# EAGLE design ESP12E_DHT22_NO_RF_NEW_v1 (EAGLE 7.4.0)
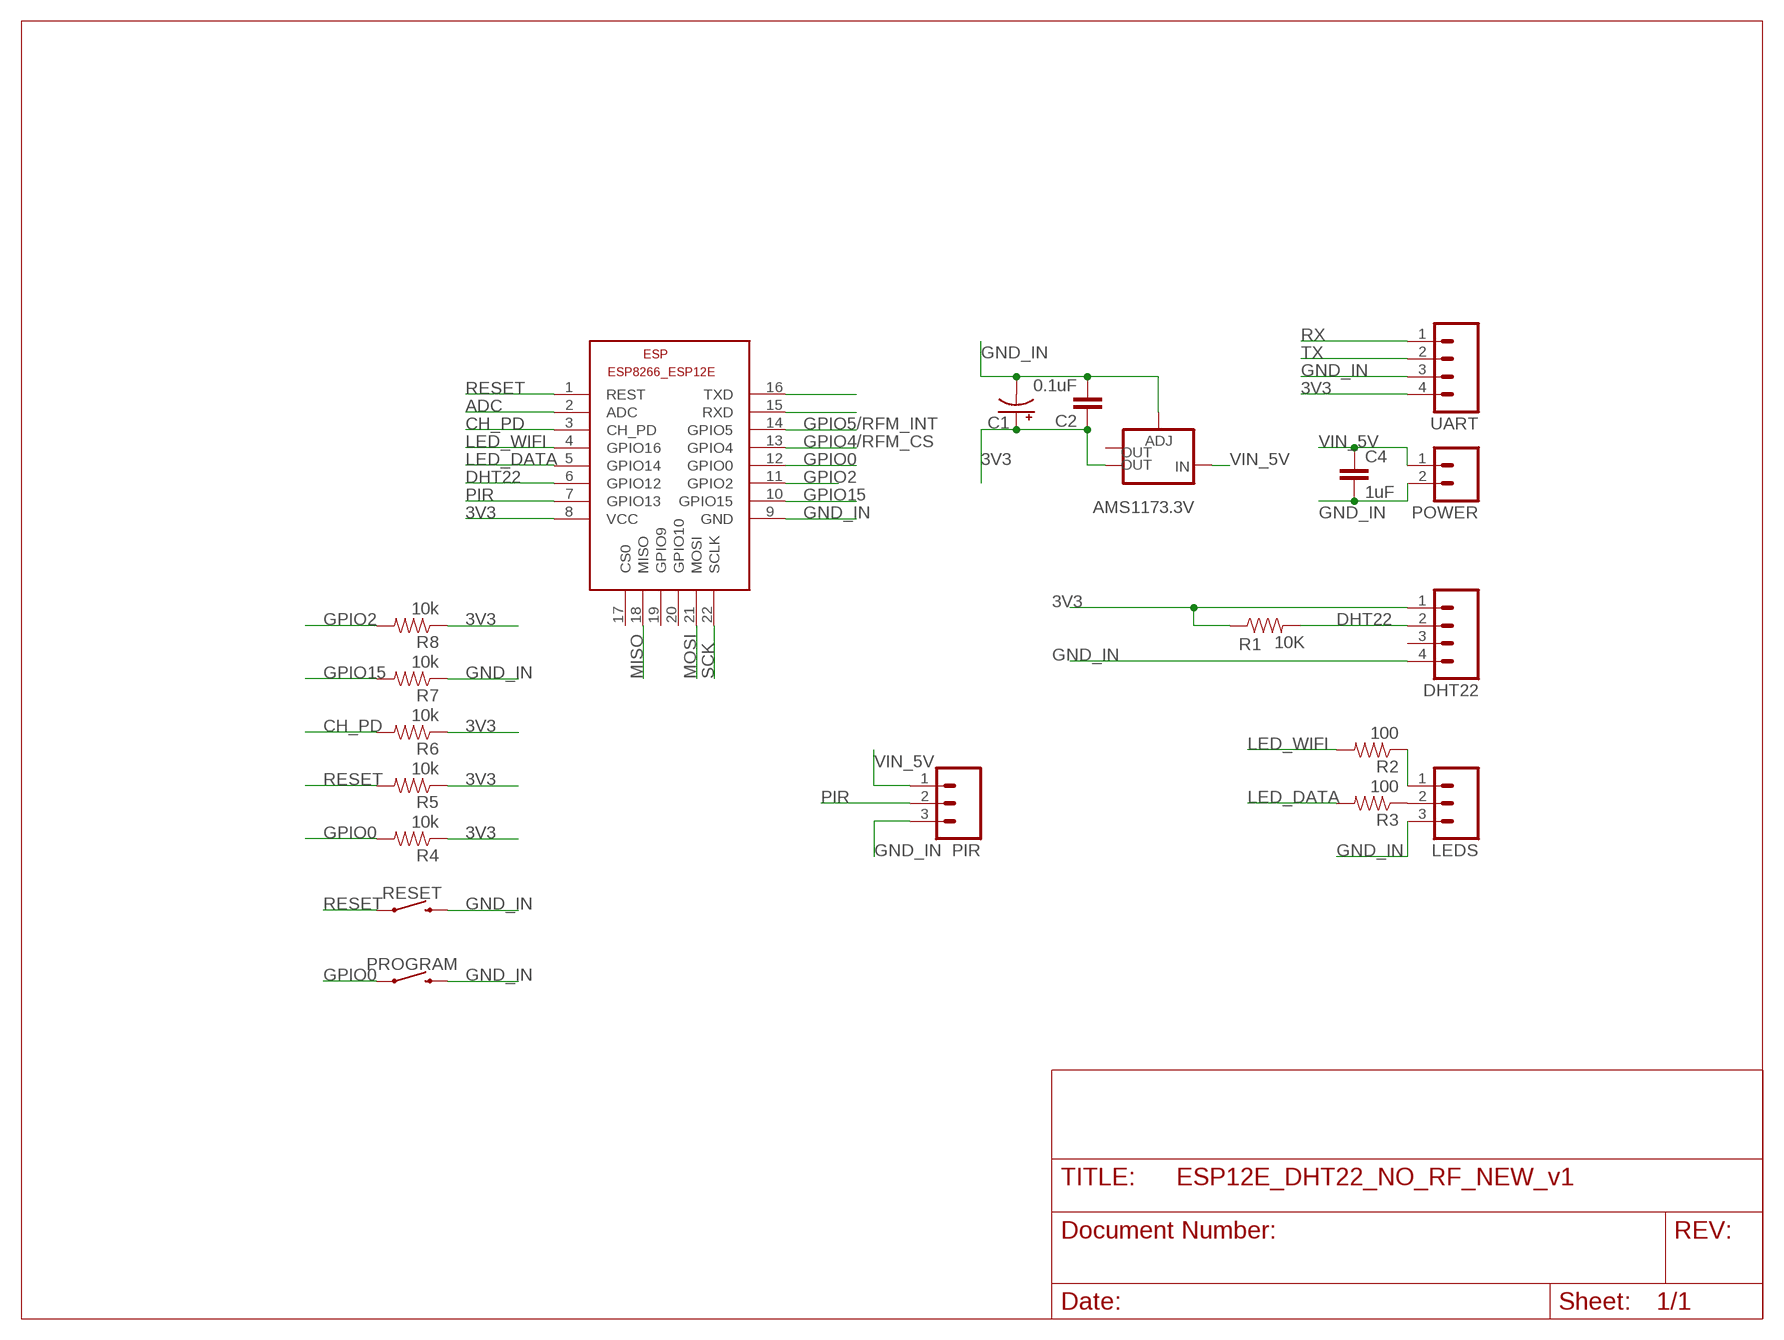
[diagram p0: schematic, sheet 1]

## Parts
AMS1173.3V  V_REG_LM1117SOT223  [SOT223]
C1  CAP_POLC  [PANASONIC_C]
C2  0.1uF  CAP0603-CAP  [0603-CAP]
C4  1uF  CAP0603-CAP  [0603-CAP]
DHT22  M04LONGPADS  [1X04_LONGPADS]
ESP  ESP8266-12EESP8266-ESP12E  [ESP8266-ESP12E]
LEDS  M03PTH  [1X03]
PIR  M03PTH  [1X03]
POWER  M02PTH  [1X02]
PROGRAM  MOMENTARY-SWITCH-SPST-PTH-6.0MM-KIT  [TACTILE_SWITCH_PTH_6.0MM_KIT]
R1  10K  10KOHM-1/10W-1%(0603)0603  [0603-RES]
R2  100  RESISTOR0603  [0603-RES]
R3  100  RESISTOR0603  [0603-RES]
R4  10k  RESISTOR0603  [0603-RES]
R5  10k  RESISTOR0603  [0603-RES]
R6  10k  RESISTOR0603  [0603-RES]
R7  10k  RESISTOR0603  [0603-RES]
R8  10k  RESISTOR0603  [0603-RES]
RESET  MOMENTARY-SWITCH-SPST-PTH-6.0MM-KIT  [TACTILE_SWITCH_PTH_6.0MM_KIT]
UART  M04LONGPADS  [1X04_LONGPADS]

## Nets
3V3: AMS1173.3V.2(OUT) C1.+ C2.1 DHT22.1 ESP.8(VCC) R1.1 R4.1 R5.1 R6.1 R8.1 UART.4
ADC: ESP.2(ADC)
CH_PD: ESP.3(CH_PD) R6.2
DHT22: DHT22.2 ESP.6(GPIO12) R1.2
GND_IN: AMS1173.3V.1(ADJ) C1.- C2.2 C4.2 DHT22.4 ESP.9(GND) LEDS.3 PIR.3 POWER.2 PROGRAM.3 R7.1 RESET.3 UART.3
GPIO0: ESP.12(GPIO0) PROGRAM.1 R4.2
GPIO2: ESP.11(GPIO2) R8.2
GPIO4/RFM_CS: ESP.13(GPIO4)
GPIO5/RFM_INT: ESP.14(GPIO5)
GPIO15: ESP.10(GPIO15) R7.2
LED_DATA: ESP.5(GPIO14) R3.2
LED_WIFI: ESP.4(GPIO16) R2.2
MISO: ESP.18(MISO)
MOSI: ESP.21(MOSI)
N$1: LEDS.2 R3.1
N$2: LEDS.1 R2.1
PIR: ESP.7(GPIO13) PIR.2
RESET: ESP.1(REST) R5.2 RESET.1
RX: ESP.16(TXD) UART.1
SCK: ESP.22(SCLK)
TX: ESP.15(RXD) UART.2
VIN_5V: AMS1173.3V.3(IN) C4.1 PIR.1 POWER.1
Unconnected: AMS1173.3V.4(OUT) DHT22.3 ESP.17(CS0) ESP.19(GPIO9) ESP.20(GPIO10)

## Library data of the parts
AMS1173.3V = SparkFun-PowerIC:V_REG_LM1117: Voltage Regulator LM1117 Standard adjustable voltage regulator but in SMD form. Spark Fun Electronics SKU : COM-00595; PROD_ID: VREG-08170
C1 = SparkFun-Capacitors:CAP_POL: Capacitor Polarized These are standard SMD and PTH capacitors. Normally 10uF, 47uF, and 100uF in electrolytic and tantalum varieties. Always verify the external diameter of the through hole cap, it varies with capacity, voltage, and manufacturer. The EIA devices should be standard.
C2 C4 = SparkFun-Capacitors:CAP: Capacitor Standard 0603 ceramic capacitor, and 0.1" leaded capacitor.
DHT22 UART = SparkFun-Connectors:M04: Header 4 Standard 4-pin 0.1" header. Use with straight break away headers (SKU : PRT-00116), right angle break away headers (PRT-00553), swiss pins (PRT-00743), machine pins (PRT-00117), and female headers (PRT-00115). Molex polarized connector foot print use with SKU : PRT-08231 with associated crimp pins and housings. 1MM SMD Version SKU: PRT-10208; PROD_ID: CONN-09696
ESP = ESP8266-ESP12E:ESP8266-12E: ESP8266-12E with additional I/O and GPIO04/05 corrected The author cannot warrant that this library is free from error or will meet your specific requirements. Created by PuceBaboon.com. Komagane, Nagano, JAPAN
LEDS PIR = SparkFun-Connectors:M03: Header 3 Standard 3-pin 0.1" header. Use with straight break away headers (SKU : PRT-00116), right angle break away headers (PRT-00553), swiss pins (PRT-00743), machine pins (PRT-00117), and female headers (PRT-00115). Molex polarized connector foot print use with SKU : PRT-08232 with associated crimp pins and housings.
POWER = SparkFun-Connectors:M02: Standard 2-pin 0.1" header. Use with - straight break away headers ( PRT-00116) - right angle break away headers (PRT-00553) - swiss pins (PRT-00743) - machine pins (PRT-00117) - female headers (PRT-00115) Molex polarized connector foot print use with: PRT-08233 with associated crimp pins and housings. 2.54_SCREWTERM for use with PRT-10571. 3.5mm Screw Terminal footprints for PRT-08084 5mm Screw Terminal footprints for use with PRT-08432
PROGRAM RESET = SparkFun-Switches:MOMENTARY-SWITCH-SPST: Momentary Switch (Pushbutton) - SPST Normally-open (NO) SPST momentary switches (buttons, pushbuttons). Variants PTH-12MM - 12mm square, through-hole Momentary Pushbutton Switch - 12mm Square <https://www.sparkfun.com/products/9190> (COM-09190) PTH-6.0MM, PTH-6.0MM-KIT - 6.0mm square, through-hole Mini Pushbutton Switch <https://www.sparkfun.com/products/97> (COM-00097) KIT package intended for soldering kit's - only one side of pads' copper is exposed. PTH-RIGHT-ANGLE-KIT - Right-angle, through-hole Right Angle Tactile Button <https://www.sparkfun.com/products/10791> - Used on SparkFun BigTime Watch Kit <https://www.sparkfun.com/products/11734> SMD-12MM - 12mm square, surface-mount Tactile Button - SMD (12mm) <https://www.sparkfun.com/products/12993> (COM-12993) Used on SparkFun PicoBoard <https://www.sparkfun.com/products/11888> SMD-4.5MM - 4.5mm Square Trackball Switch Used on SparkFun Blackberry Trackballer Breakout <https://www.sparkfun.com/products/13169> SMD-4.6MMX2.8MM - 4.60mm x 2.80mm, surface mount Used on SparkFun SAMD21 Mini Breakout <https://www.sparkfun.com/products/13664> SMD-5.2MM, SMD-5.2-REDUNDANT - 5.2mm square, surface-mount Mini Pushbutton Switch - SMD <https://www.sparkfun.com/products/8720> (COM-08720) Used on Arduino Pro Mini <https://www.sparkfun.com/products/11114> REDUNDANT package connects both switch circuits together SMD-6.0X3.5MM - 6.0 x 3.5mm, surface mount Momentary Reset Switch SMD <https://www.sparkfun.com/products/8229> (COM-08229) SMD-6.2MM-TALL - 6.2mm square, surface mount Tactile Button - SMD (6mm) <https://www.sparkfun.com/products/12992> Used on SparkFun Digital Sandbox <https://www.sparkfun.com/products/12651> SMD-RIGHT-ANGLE - Right-angle, surface mount Used on SparkFun Block for Intel® Edison - Arduino <https://www.sparkfun.com/products/13036>; PROD_ID: SWCH-08441; SF_SKU: COM-00097
R1 = SparkFun-Resistors:10KOHM-1/10W-1%(0603): RES-00824; PROD_ID: RES-00824
R2-R8 = SparkFun-Resistors:RESISTOR: Resistor Basic schematic elements and footprints for 0603, 1206, and PTH resistors.

## Net classes
0 default: width 0.406 mm, drill 0.254 mm, clearance 0.305 mm

## Board
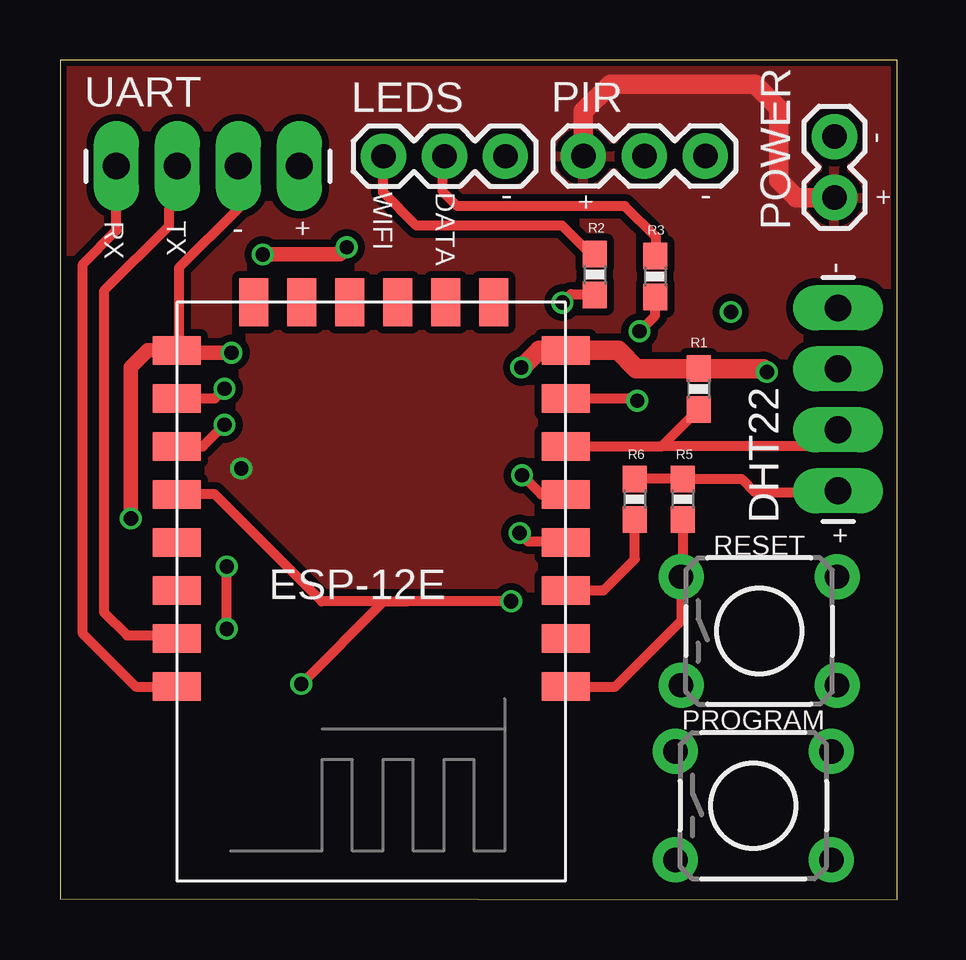
[diagram p1: board, top side]
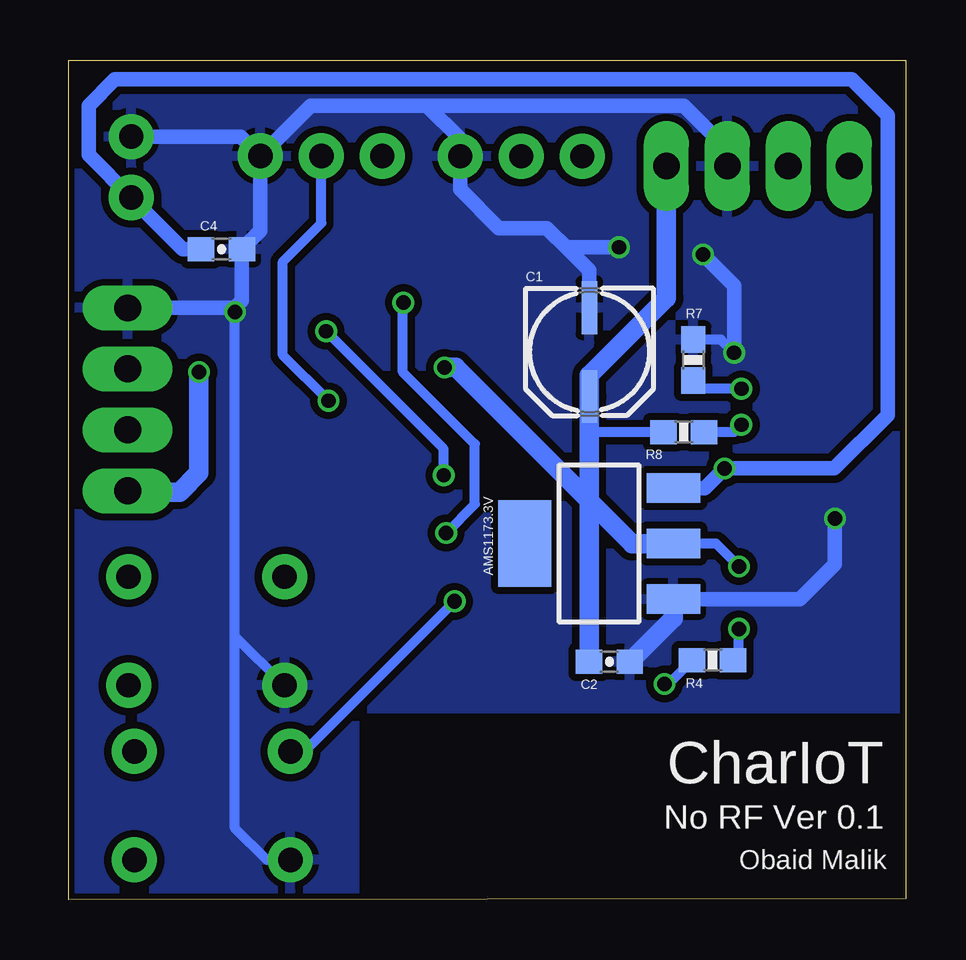
[diagram p2: board, bottom side, seen from below]

Size 34.88 x 34.98 mm. Coordinates in mm from the lower left corner, seen from the top.
Outline: 0.01,0.04 34.88,0 34.88,34.98 0,34.98 0.01,0.04
Copper layers (1*16): Top 0.035mm / dielectric 1.5mm / Bottom 0.035mm
Design rules "Fusion_eagle_rule_v1.1": minimum track width 6mil, minimum drill 12mil, track to track 6mil, track to pad 6mil, pad to pad 6mil, via to via 6mil, smd to smd 0mil, copper to edge 10mil, drill to drill 10mil, minimum pad ring 10mil, minimum via ring 6mil, stop-mask expansion 2mil, vias tented up to drill 100mil, thermal gap 10mil

### Footprints (pad centres in the part's own frame; a part is rotated, then mirrored left to right if it is on the bottom)
SOT223 = smd 1.219 x 2.235: 1 -2.311,-3.099; 2 0,-3.099; 3 2.311,-3.099 | smd 3.6 x 2.2: 4 0,3.099
PANASONIC_C = smd 2.2 x 0.65: + 1.9,-0.2; - -1.8,-0.2
0603-CAP = smd 1.1 x 1: 1 -0.85,0; 2 0.85,0
1X04_LONGPADS = drill 1.118 pad 1.88 long: 1 0,0; 2 2.54,0; 3 5.08,0; 4 7.62,0
ESP8266-ESP12E = smd 2 x 1.2: 1 -7.62,5.84; 2 -7.62,3.84; 3 -7.62,1.84; 4 -7.62,-0.16; 5 -7.62,-2.16; 6 -7.62,-4.16; 7 -7.62,-6.16; 8 -7.62,-8.16; 9 8.58,-8.16; 10 8.58,-6.16; 11 8.58,-4.16; 12 8.58,-2.16; 13 8.58,-0.16; 14 8.58,1.84; 15 8.58,3.84; 16 8.58,5.84 | smd 1.2 x 2: 17 -4.62,-10.16; 18 -2.62,-10.16; 19 -0.62,-10.16; 20 1.38,-10.16; 21 3.38,-10.16; 22 5.38,-10.16
1X03 = drill 1.016 pad 1.88: 1 0,0; 2 2.54,0; 3 5.08,0
1X02 = drill 1.016 pad 1.88: 1 0,0; 2 2.54,0
TACTILE_SWITCH_PTH_6.0MM_KIT = drill 1.016 pad 1.88: 1 -3.251,2.261; 2 3.251,2.261; 3 -3.251,-2.261; 4 3.251,-2.261
0603-RES = smd 1.1 x 1: 1 -0.85,0; 2 0.85,0

### Placement (x,y rotation side)
AMS1173.3V  12.78,14.83 90 bottom
C1  12.98,22.86 270 bottom
C2  12.35,9.9 0 bottom
C4  28.51,27.1 0 bottom
DHT22  32.42,17.03 90 top
ESP  13.45,14.72 180 top
LEDS  13.48,30.97 0 top
PIR  21.81,30.98 0 top
POWER  32.27,29.25 90 top
PROGRAM  28.89,3.91 0 top
R1  26.61,21.27 270 top
R2  22.29,26.04 270 top
R3  24.8,25.96 270 top
R4  8.05,9.98 180 bottom
R5  25.95,16.68 270 top
R6  23.95,16.68 270 top
R7  8.85,22.48 270 bottom
R8  9.25,19.48 0 bottom
RESET  29.13,11.19 0 top
UART  2.35,30.56 0 top

### Tracks (layer width: path | path; a pad name or v marks a point on that pad's centre or on a via)
3V3  (via drill 0.6)
  Top 0.406: 19.24,22.15 19.23,22.15 v19.22,22.17 | R6.1 R5.1 28.4,17.53 28.95,16.98 32.37,16.98 DHT22.1 | v6.95,11.28 v6.95,13.88
  Top 0.813: 19.24,22.15 19.97,22.88 ESP.8 23.25,22.88 24.01,22.12 R1.1 29.31,22.12 v29.45,21.98
  Bottom 0.406: R4.1 6.95,10.23 v6.95,11.28 | AMS1173.3V.2 7.9,14.83 v6.95,13.88 | R8.1 13.18,19.48 13.18,19.98
  Bottom 0.813: AMS1173.3V.2 11.4,14.83 13.18,16.61 | 13.18,16.61 13.18,19.98 C1.+ 13.18,21.85 9.97,25.06 UART.4 | 13.18,16.61 18.74,22.17 v19.22,22.17 | C2.1 13.18,9.92 13.18,16.61 | v29.45,21.98 29.45,17.78 30.25,16.98 32.37,16.98 DHT22.1
CH_PD
  Top 0.406: ESP.3 22.65,12.88 23.95,14.18 R6.2
DHT22
  Top 0.406: DHT22.2 32.31,19.54 31.65,18.88 25.07,18.88 | ESP.6 24.95,18.88 25.07,18.88 | 25.07,18.88 R1.2
GND_IN  (via drill 0.6)
  Top 0.406: 4.93,23.09 ESP.9 | UART.3 7.42,30.21 7.42,28.78 4.95,26.32 4.95,22.98 | 28.12,24.65 v27.95,24.48
  Top 0.61: v2.95,15.88 2.95,22.18 3.65,22.88 ESP.9 | v8.45,26.88 11.65,26.88 v11.95,27.18 | 4.93,23.09 5.24,22.78 v7.15,22.78
  Bottom 0.406: 7.43,31.26 UART.3 | PROGRAM.3 26.62,1.65 27.95,2.98 27.95,10.98 | RESET.3 25.9,8.93 27.95,10.98 | 27.95,10.98 v27.95,24.48 | 27.95,26.81 C4.2 | v7.15,22.78 7.7,23.33 R7.1
  Bottom 0.61: PIR.3 26.89,27.87 C4.2 27.66,24.94 27.95,24.65 | PIR.3 27.7,31.79 POWER.2 | PIR.3 24.79,33.08 19.95,33.08 | AMS1173.3V.1 4.41,12.52 2.95,13.98 v2.95,15.88 | DHT22.4 27.95,24.65 | 27.95,24.65 v27.95,24.48 | 7.43,31.26 9.25,33.08 19.95,33.08 | 19.95,33.08 18.56,31.69 LEDS.3 18.56,29.59 16.95,27.98 14.95,27.98 14.05,27.08 | C1.- 13.18,26.21 14.05,27.08 | v7.15,22.78 7.15,25.58 v8.45,26.88 | v11.95,27.18 13.95,27.18 14.05,27.08
  Bottom 0.813: C2.2 9.68,11.72 AMS1173.3V.1
  pour Bottom: -1.29,35.77 36.46,35.77 36.46,35.54 36.53,35.54 36.45,-1.02 22.95,-1.02 22.95,7.98 -0.05,7.98 -0.05,-1.1 -1.21,-1.1 -1.21,35.69
GPIO0  (via drill 0.6, 0.61)
  Top 0.406: v18.8,12.43 14.45,12.43 13.5,12.43 | 13.5,12.43 10.9,12.43 6.45,16.88 ESP.12 4.93,17.05 | v10.05,8.98 13.5,12.43
  Bottom 0.406: v18.8,12.43 24.84,6.38 25.55,6.38 PROGRAM.1 | R4.2 9.9,8.98 v10.05,8.98
GPIO2  (via drill 0.6)
  Top 0.406: ESP.11 5.95,18.88 v6.85,19.78
  Bottom 0.406: v6.85,19.78 7.15,19.48 R8.2
GPIO15  (via drill 0.6)
  Top 0.406: ESP.10 6.45,20.88 v6.85,21.28
  Bottom 0.406: v6.85,21.28 8.5,21.28 R7.2
LED_DATA  (via drill 0.6)
  Top 0.406: ESP.5 20.05,16.88 v19.25,17.68 | v24.15,23.68 24.8,24.33 R3.2
  Bottom 0.406: v19.25,17.68 19.25,18.78 v24.15,23.68
LED_WIFI  (via drill 0.61)
  Top 0.406: v20.93,24.87 21.29,25.23 22,25.23 R2.2 | v19.15,15.27 19.51,14.92 20.93,14.92 ESP.4
  Bottom 0.406: v20.93,24.87 20.95,24.85 20.95,21.98 17.95,18.98 17.95,16.47 v19.15,15.27
N$1
  Top 0.406: R3.1 24.84,27.01 24.84,27.59 23.54,28.89 16.56,28.89 15.95,29.5 15.95,30.92 LEDS.2
N$2
  Top 0.406: R2.1 22,27.01 20.92,28.08 14.85,28.08 13.46,29.47 13.46,30.92 LEDS.1
PIR  (via drill 0.6)
  Top 0.406: ESP.7 23.95,20.88 v24.05,20.78
  Bottom 0.406: v24.05,20.78 25.95,22.68 25.95,26.58 24.35,28.18 PIR.2
RESET
  Top 0.406: ESP.1 21.29,8.87 23.14,8.87 25.91,11.64 25.91,13.14 RESET.1 25.95,13.52 R5.2
RX
  Top 0.406: ESP.16 4.57,8.87 3.15,8.87 0.95,11.07 0.95,26.48 2.35,27.88 UART.1 2.44,30.21
TX
  Top 0.406: ESP.15 4.57,11 2.8,11 1.85,11.95 1.85,25.38 4.55,28.08 4.55,28.76 4.57,28.78 4.57,30.21 UART.2
VIN_5V  (via drill 0.6)
  Top 0.813: PIR.1 21.81,32.84 22.95,33.98 28.95,33.98 29.95,32.98 29.95,29.98 30.68,29.25 POWER.1
  Bottom 0.406: 29.46,27.36 C4.1 | 32.31,29.14 POWER.1 | 9.91,17.4 AMS1173.3V.3
  Bottom 0.61: C4.1 30.12,27.1 POWER.1 34.05,31.03 34.05,33.08 32.95,34.18 2.25,34.18 0.75,32.68 0.75,20.18 2.97,17.96 v7.55,17.96 8.37,17.14 AMS1173.3V.3
  pour Top: 39.46,38.26 39.46,-3.27 22.95,-3.32 22.95,7.98 -0.05,7.98 -0.05,-3.27 -2.24,-3.27 -2.24,38.35

### Text on the board
tNames: - | WIFI | DATA | - | + | - | + | RX | TX | - | + | - | +
bNames: CharIoT | No RF Ver 0.1 | Obaid Malik